# EAGLE design brick_serial_ble (EAGLE 7.2.0)
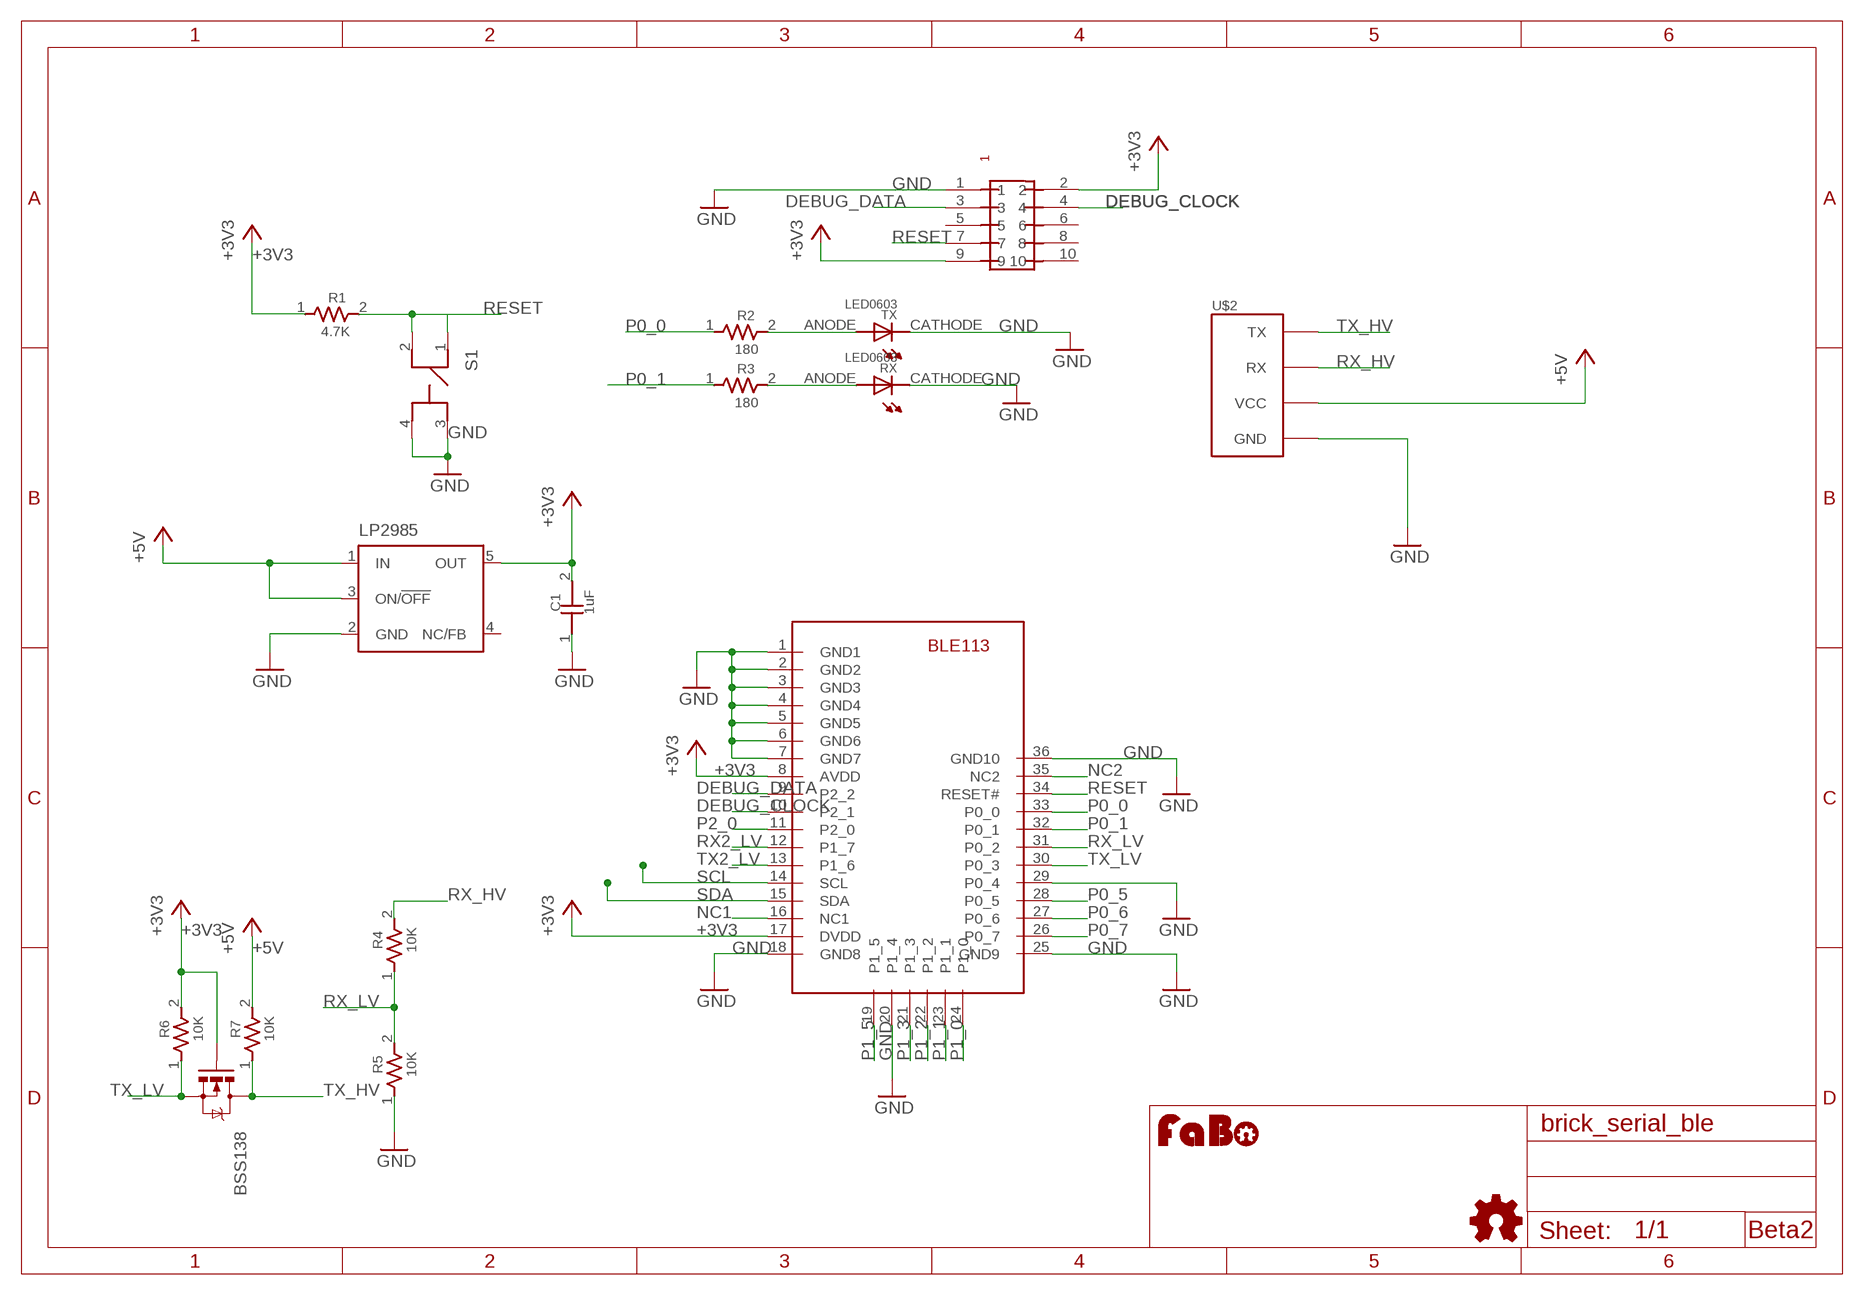
[diagram p0: schematic, sheet 1]

## Parts
BSS138  MOSFET-NCHANNELSMD  [SOT23-3]
C1  1uF  CAPACITOR0603  [0603]
LP2985  LP2985-XXDBVR33  [SOT23-DBV]
R1  4.7K  RESISTOR0603  [0603]
R2  180  RESISTOR0603  [0603]
R3  180  RESISTOR0603  [0603]
R4  10K  RESISTOR0603  [0603]
R5  10K  RESISTOR0603  [0603]
R6  10K  RESISTOR0603  [0603]
R7  10K  RESISTOR0603  [0603]
RX  LED0603  [0603]
S1  SWITCH-LS6J2M-T  [SWITCH-LS6J2M-T]
TX  LED0603  [0603]
U$1  PIN-HEADER-SMT(1.27MM)2X5  [PIN-HEADER-SMT(1.27MM)2X5]
U$2  BRICK_SERIAL  [BRICK_SERIAL]
U$3  LOGO_FABO-S  [LOGO_FABO_S]
U$4  LOGO_OSHW-S  [LOGO_OSHW_S]
U$6  BLUEGIGA-BLE113  [BLUEGIGA-BLE113]

## Nets
+3V3: BSS138.1(G) C1.2 LP2985.5(OUT) R1.1 R6.2 U$1.2 U$1.9 U$6.8(AVDD) U$6.17(DVDD)
+5V: LP2985.1(IN) LP2985.3(ON/!OFF) R7.2 U$2.VCC
DEBUG_CLOCK: U$1.4 U$6.10(P2_1)
DEBUG_DATA: U$1.3 U$6.9(P2_2)
GND: C1.1 LP2985.2(GND) R5.1 RX.CATHODE S1.3 S1.4 TX.CATHODE U$1.1 U$2.GND U$6.1(GND1) U$6.2(GND2) U$6.3(GND3) U$6.4(GND4) U$6.5(GND5) U$6.6(GND6) U$6.7(GND7) U$6.18(GND8) U$6.20(P1_4) U$6.25(GND9) U$6.29(P0_4) U$6.36(GND10)
N$1: R2.2 TX.ANODE
N$2: R3.2 RX.ANODE
NC1: U$6.16(NC1)
NC2: U$6.35(NC2)
P0_0: R2.1 U$6.33(P0_0)
P0_1: R3.1 U$6.32(P0_1)
P0_5: U$6.28(P0_5)
P0_6: U$6.27(P0_6)
P0_7: U$6.26(P0_7)
P1_0: U$6.24(P1_0)
P1_1: U$6.23(P1_1)
P1_2: U$6.22(P1_2)
P1_3: U$6.21(P1_3)
P1_5: U$6.19(P1_5)
P2_0: U$6.11(P2_0)
RESET: R1.2 S1.1 S1.2 U$1.7 U$6.34(RESET#)
RX2_LV: U$6.12(P1_7)
RX_HV: R4.2 U$2.RX
RX_LV: R4.1 R5.2 U$6.31(P0_2)
SCL: U$6.14(SCL)
SDA: U$6.15(SDA)
TX2_LV: U$6.13(P1_6)
TX_HV: BSS138.3(D) R7.1 U$2.TX
TX_LV: BSS138.2(S) R6.1 U$6.30(P0_3)
Unconnected: LP2985.4(NC/FB) U$1.5 U$1.6 U$1.8 U$1.10

## Notes on the sheet
- Beta2

## Library data of the parts
BSS138 = SparkFun:MOSFET-NCHANNEL
C1 = GClue-Capacitor:CAPACITOR
LP2985 = SmartPrj:LP2985-XXDBVR: ULTRALOW-POWER 50-mA LOW-DROPOUT LINEAR REGULATORS 50-mA Low-Dropout Regulator Source: http://focus.ti.com/lit/ds/symlink/tps77001.pdf
R1-R7 = GClue-Resistors:RESISTOR
RX TX = GClue-LED:LED
S1 = gclue:SWITCH-LS6J2M-T: Switch Tact SMD(LS6J2M-T)
U$1 = gclue:PIN-HEADER-SMT(1.27MM)2X5: PIN-HEADER-SMT (1.27MM) 2x5
U$2 = gclue:BRICK_SERIAL: FaBo Brick 4pin(SERIAL)
U$3 = FaBo:LOGO_FABO
U$4 = gclue:LOGO_OSHW
U$6 = gclueBT:BLUEGIGA-BLE113: Bluegiga BLE113 Bluetooth Bluetooth 4.0 low energy radio Radio Transmit power: +0 dBm Receiver sensitivity: -93 dBm Typical line-of-sight range: 30 - 100 meters Current Consumption TX peak current: 18.2 mA, 14.3 ma (with DC/DC) RX peak current: 17.9 mA Power mode 1: 270 uA Power mode 2: 1 uA Power mode 3: 0.4 uA Certifications Japan: MIC Japan( 007-AB0103)

## Net classes
0 default: clearance 0.254 mm

## Board
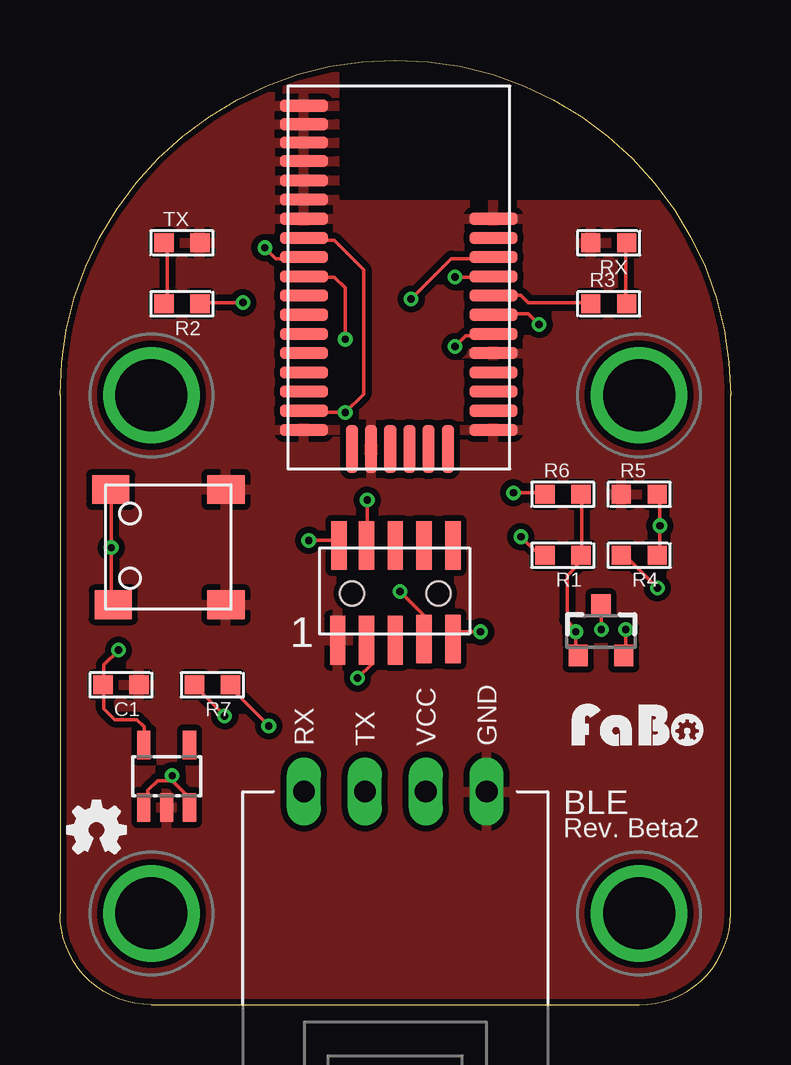
[diagram p1: board, top side]
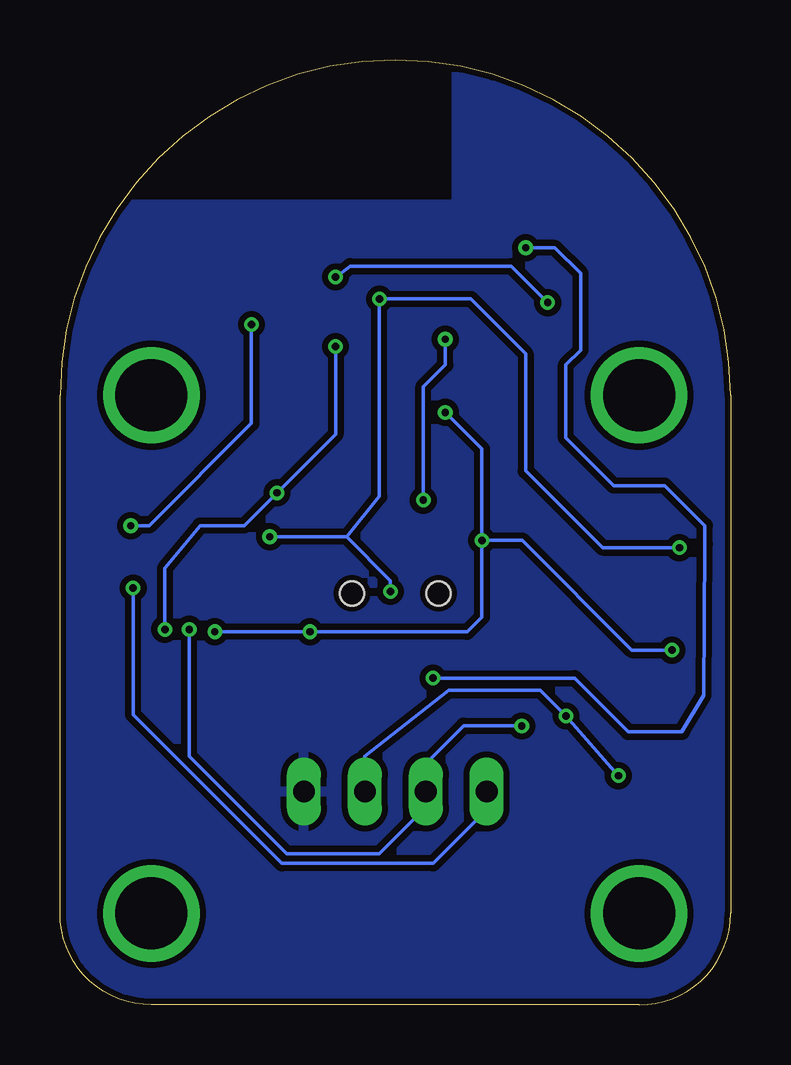
[diagram p2: board, bottom side, seen from below]

Size 27.94 x 39.37 mm. Coordinates in mm from the lower left corner, seen from the top.
Copper layers (1*16): Top 0.035mm / dielectric 1.5mm / Bottom 0.035mm
Design rules "Elecrow_2-layer_eagle_rule": minimum track width 6mil, minimum drill 12mil, track to track 6mil, track to pad 6mil, pad to pad 6mil, via to via 6mil, smd to smd 0mil, copper to edge 10mil, drill to drill 10mil, minimum pad ring 10mil, minimum via ring 6mil, stop-mask expansion 2mil, vias tented up to drill 100mil, thermal gap 10mil
tKeepout: area 11.3,33.1 to 29.3,43.1
bKeepout: area 11.3,33.1 to 29.3,43.1

### Footprints (pad centres in the part's own frame; a part is rotated, then mirrored left to right if it is on the bottom)
SOT23-3 = smd 0.8 x 0.9: 1 -0.95,-1; 2 0.95,-1; 3 0,1.1
0603 = smd 0.8 x 0.8: 1 -0.75,0; 2 0.75,0
SOT23-DBV = smd 0.55 x 1.2: 1 -0.95,-1.3; 2 0,-1.3; 3 0.95,-1.3; 4 0.95,1.3; 5 -0.95,1.3
0603' = smd 0.8 x 0.8: ANODE -0.75,0; CATHODE 0.75,0
SWITCH-LS6J2M-T = smd 1.55 x 1.2: 1 -2.4,2.4; 2 -2.3,-2.4; 3 2.4,2.4; 4 2.4,-2.4
PIN-HEADER-SMT(1.27MM)2X5 = smd 0.635 x 2.032: 1 -2.4,-1.95; 2 -2.35,2; 3 -1.2,-1.95; 4 -1.2,2; 5 0,-1.95; 6 0,2; 7 1.2,-1.9; 8 1.2,2; 9 2.4,-1.9; 10 2.4,2 | hole 1: 1.8,0; -1.8,0
BRICK_SERIAL = drill 0.9 long: GND 3.81,-10.16; RX -3.81,-10.16; TX -1.27,-10.16; VCC 1.27,-10.16 | drill 3 pad 3.81: P$5 -10.16,6.35; P$6 10.16,6.35; P$7 -10.16,-15.24; P$8 10.16,-15.24
BLUEGIGA-BLE113 = smd 2 x 0.5: 1 -3.81,6.35; 2 -3.81,5.58; 3 -3.81,4.81; 4 -3.81,4.04; 5 -3.81,3.24; 6 -3.81,2.44; 7 -3.81,1.64; 8 -3.81,0.84; 9 -3.81,0.04; 10 -3.81,-0.76; 11 -3.81,-1.56; 12 -3.81,-2.36; 13 -3.81,-3.16; 14 -3.81,-3.96; 15 -3.81,-4.76; 16 -3.81,-5.56; 17 -3.81,-6.36; 18 -3.81,-7.16; 25 4.09,-7.16; 26 4.09,-6.36; 27 4.09,-5.56; 28 4.09,-4.76; 29 4.09,-3.96; 30 4.09,-3.16; 31 4.09,-2.36; 32 4.09,-1.56; 33 4.09,-0.76; 34 4.09,0.04; 35 4.09,0.84; 36 4.09,1.64 | smd 0.5 x 2: 19 -1.81,-7.96; 20 -1.01,-7.96; 21 -0.21,-7.96; 22 0.59,-7.96; 23 1.39,-7.96; 24 2.19,-7.96

### Placement (x,y rotation side)
BSS138  22.54,15.56 0 top
C1  2.54,13.34 180 top
LP2985  4.45,9.53 0 top
R1  20.95,18.73 180 top
R2  5.08,29.21 180 top
R3  22.86,29.21 0 top
R4  24.13,18.73 180 top
R5  24.13,21.27 0 top
R6  20.95,21.27 0 top
R7  6.35,13.34 180 top
RX  LED0603  [0603']  22.86,31.75 180 top
S1  4.51,19.07 0 top
TX  LED0603  [0603']  5.08,31.75 0 top
U$1  13.97,17.14 0 top
U$2  13.97,19.05 0 top
U$3  24.13,10.79 0 top
U$4  1.52,7.29 0 top
U$6  13.97,31.11 0 top

### Tracks (layer width: path | path; a pad name or v marks a point on that pad's centre or on a via)
+3V3  (via drill 0.3)
  Top 0.152: R6.2 21.74,21.34 21.95,21.13 21.74,20.93 21.74,18.9 R1.1 21.54,18.69 21.54,18.29 21.13,17.88 21.13,16.05 v21.49,15.54 21.49,14.63 BSS138.1 | 1.83,13.21 1.83,12.34 2.29,11.89 3.2,11.89 3.5,11.58 3.5,11.12 3.66,10.97 LP2985.5 | v2.44,14.78 1.83,14.17 1.83,13.21 | 1.83,13.21 C1.2 | U$6.17 10.36,24.69 v11.89,24.69 12.65,25.45 12.65,30.63 11.43,31.85 10.21,31.85 10.16,31.9 U$6.8 | v10.36,19.36 11.58,19.36 11.58,19.3 U$1.2 | v17.53,15.54 16.46,15.54 U$1.9
  Bottom 0.152: v10.36,19.36 10.36,23.16 v11.89,24.69 | v10.36,19.36 10.36,16.15 10.97,15.54 v17.53,15.54 v21.49,15.54 | v2.44,14.78 4.12,14.78 8.69,19.36 v10.36,19.36
+5V  (via drill 0.3)
  Top 0.152: 4.67,9.35 4.06,9.35 3.66,8.94 3.66,8.33 LP2985.1 | 4.67,9.35 5.28,8.74 5.28,8.33 LP2985.3 | v6.86,12.04 5.69,13.21 R7.2 | v4.67,9.55 4.67,9.35
  Bottom 0.152: U$2.VCC 15.24,10.36 11.73,13.11 7.92,13.11 v6.86,12.04 v4.67,9.55
DEBUG_CLOCK  (via drill 0.3)
  Top 0.152: v11.89,27.74 11.89,29.87 11.43,30.33 10.06,30.33 U$6.10 | v12.8,21.03 12.8,19.3 U$1.4
  Bottom 0.152: v11.89,27.74 11.89,26.67 12.8,25.76 v12.8,21.03
DEBUG_DATA  (via drill 0.3)
  Top 0.152: v8.53,31.55 8.99,31.09 10.06,31.09 U$6.9 | v12.39,13.61 13.01,14.22 13.01,14.83 12.8,15.04 U$1.3
  Bottom 0.152: v8.53,31.55 7.32,31.55 6.25,30.48 6.25,27.28 6.86,26.67 6.86,23.62 4.88,21.64 2.74,21.64 1.07,19.96 1.07,19.2 1.12,12.9 2.03,11.38 4.27,11.38 6.5,13.61 v12.39,13.61
GND
  pour Bottom: 11.43,33.34 28.57,33.34 28.57,-0.64 -0.64,-0.64 -0.64,39.69 11.43,39.69
  pour Top: 11.43,33.34 28.57,33.34 28.57,-0.64 -0.64,-0.64 -0.64,39.69 11.43,39.69
N$1
  Top 0.152: R2.2 4.47,29.26 4.47,31.7 TX.ANODE
N$2
  Top 0.152: R3.2 23.57,29.26 23.57,31.7 RX.ANODE
P0_0  (via drill 0.3)
  Top 0.152: v7.62,29.26 5.94,29.26 R2.1 | v16.46,30.33 17.83,30.33 17.88,30.28 U$6.33
  Bottom 0.152: v7.62,29.26 9.14,30.79 15.85,30.79 v16.46,30.33
P0_1
  Top 0.152: R3.1 21.95,29.26 19.51,29.26 19.2,29.57 18.29,29.57 U$6.32
RESET  (via drill 0.3)
  Top 0.152: S1.2 2.13,16.76 v2.13,19.05 2.13,21.34 S1.1 | v19.2,19.51 19.96,18.75 20.12,18.75 R1.2 | v14.17,17.22 15.24,16.15 15.09,16.15 U$1.7 | v14.63,29.41 16.31,31.09 17.98,31.09 U$6.34
  Bottom 0.152: 16,19.51 v19.2,19.51 | 16,19.51 14.17,17.68 v14.17,17.22 | 16,19.51 14.63,21.18 v14.63,29.41 10.82,29.41 8.53,27.13 8.53,22.25 5.33,19.05 v2.13,19.05
RX_HV  (via drill 0.3)
  Top 0.152: v24.89,17.37 23.57,18.69 R4.2
  Bottom 0.152: v24.89,17.37 24.89,12.09 18.69,5.89 12.39,5.89 10.16,8.13 U$2.RX
RX_LV  (via drill 0.3)
  Top 0.152: R4.1 24.99,18.9 v24.99,19.96 24.99,20.93 25.2,21.13 24.99,21.34 R5.2 | v19.96,28.35 19.51,28.8 18.14,28.8 U$6.31
  Bottom 0.152: v24.99,19.96 24.23,19.96 19.96,24.23 v19.96,28.35
TX_HV  (via drill 0.3)
  Top 0.152: v8.7,11.62 7.11,13.21 R7.1 | v22.55,15.65 22.55,16.46 BSS138.3
  Bottom 0.152: v8.7,11.62 11.12,11.63 12.6,10.16 12.6,8.94 U$2.TX 12.8,8.74 12.8,8.13 14.63,6.3 18.49,6.3 22.55,10.36 v22.55,15.65
TX_LV  (via drill 0.3)
  Top 0.152: v18.9,21.34 20.12,21.34 R6.1 | v16.46,27.43 16.92,27.89 17.98,27.89 U$6.30 | v23.57,15.65 23.57,14.63 BSS138.2
  Bottom 0.152: v16.46,27.43 16.46,23.77 v18.9,21.34 20.27,19.96 22.1,19.96 23.57,18.19 v23.57,15.65

### Text on the board
tPlace: BLE | Rev. Beta2